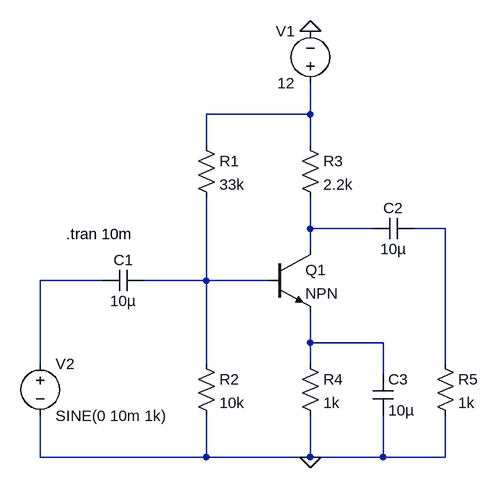
[diagram p0: schematic 6-ce.asc]
6-ce.asc, the LTspice schematic file:
Version 4.1
SHEET 1 880 680
WIRE 288 -80 288 -128
WIRE 288 -80 128 -80
WIRE 128 -32 128 -80
WIRE 288 -32 288 -80
WIRE 288 96 288 48
WIRE 384 96 288 96
WIRE 496 96 448 96
WIRE 288 128 288 96
WIRE -32 176 -128 176
WIRE 128 176 128 48
WIRE 128 176 32 176
WIRE 224 176 128 176
WIRE 288 272 288 224
WIRE 400 272 288 272
WIRE -128 304 -128 176
WIRE 128 304 128 176
WIRE 288 304 288 272
WIRE 496 304 496 96
WIRE 400 320 400 272
WIRE -128 448 -128 384
WIRE 128 448 128 384
WIRE 128 448 -128 448
WIRE 288 448 288 384
WIRE 288 448 128 448
WIRE 400 448 400 384
WIRE 400 448 288 448
WIRE 496 448 496 384
WIRE 496 448 400 448
FLAG 288 448 0
FLAG 288 -208 0
SYMBOL npn 224 128 R0
SYMATTR InstName Q1
SYMBOL voltage 288 -112 R180
WINDOW 0 24 96 Left 2
WINDOW 3 24 16 Left 2
SYMATTR InstName V1
SYMATTR Value 12
SYMBOL res 112 -48 R0
SYMATTR InstName R1
SYMATTR Value 33k
SYMBOL res 112 288 R0
SYMATTR InstName R2
SYMATTR Value 10k
SYMBOL res 272 -48 R0
SYMATTR InstName R3
SYMATTR Value 2.2k
SYMBOL res 272 288 R0
SYMATTR InstName R4
SYMATTR Value 1k
SYMBOL res 480 288 R0
SYMATTR InstName R5
SYMATTR Value 1k
SYMBOL voltage -128 288 R0
WINDOW 123 0 0 Left 0
WINDOW 39 0 0 Left 0
SYMATTR InstName V2
SYMATTR Value SINE(0 10m 1k)
SYMBOL cap 448 80 R90
WINDOW 0 0 32 VBottom 2
WINDOW 3 32 32 VTop 2
SYMATTR InstName C2
SYMATTR Value 10µ
SYMBOL cap 384 320 R0
SYMATTR InstName C3
SYMATTR Value 10µ
SYMBOL cap 32 160 R90
WINDOW 0 0 32 VBottom 2
WINDOW 3 32 32 VTop 2
SYMATTR InstName C1
SYMATTR Value 10µ
TEXT -88 104 Left 2 !.tran 10m

The netlist it stands for:
* 6-ce.asc
Q1 N002 N005 N006 0 NPN
V1 N001 0 12
R1 N001 N005 33k
R2 N005 0 10k
R3 N001 N002 2.2k
R4 N006 0 1k
R5 N003 0 1k
V2 N004 0 SINE(0 10m 1k)
C2 N003 N002 10µ
C3 N006 0 10µ
C1 N005 N004 10µ
.model NPN NPN
.model PNP PNP
.lib standard.bjt
.tran 10m
.backanno
.end